# EAGLE design UAVCAN_HUB_0.1 (EAGLE 7.7.0)
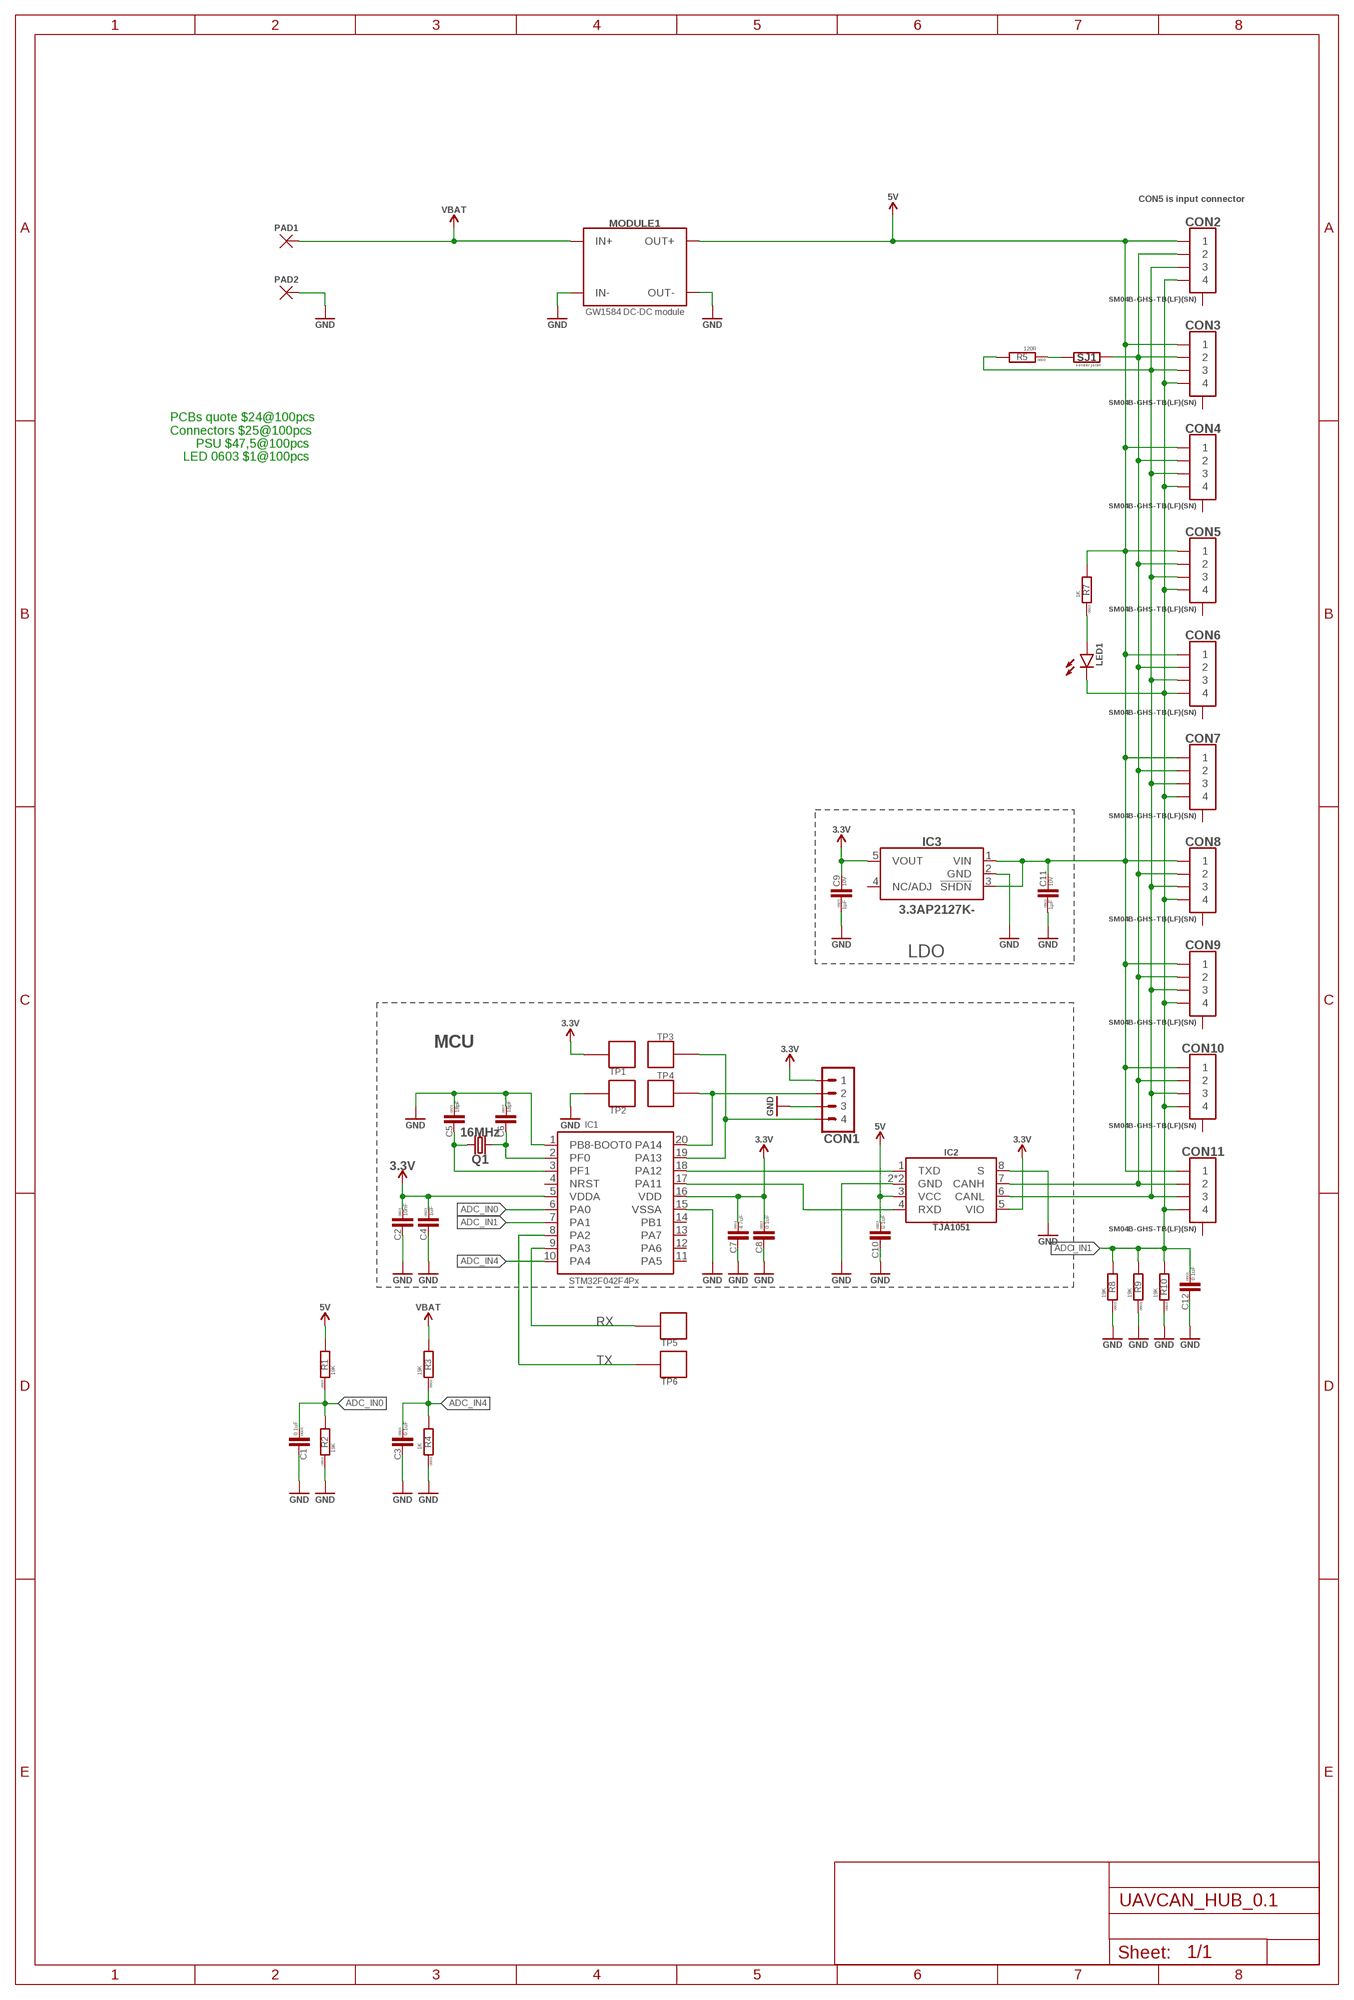
[diagram p0: schematic, sheet 1]

## Parts
C1  0.1uF  C-0603  [C0603]
C2  10nF  C-0603  [C0603]
C3  0.1uF  C-0603  [C0603]
C4  1uF  C-0603  [C0603]
C5  18pF  C-0603  [C0603]
C6  18pF  C-0603  [C0603]
C7  4.7uF  C-0603  [C0603]
C8  0.1uF  C-0603  [C0603]
C9  1µF  1µF-10V_10%_X7R-0603  [C0603]
C10  0.1uF  C-0603  [C0603]
C11  1µF  1µF-10V_10%_X7R-0603  [C0603]
C12  0.1uF  C-0603  [C0603]
CON1  PINHEAD_1X04-2.54  [1X04-PTH-2.54]
CON2  CON-4P-JST_GH  [JST_GH-4P]
CON3  CON-4P-JST_GH  [JST_GH-4P]
CON4  CON-4P-JST_GH  [JST_GH-4P]
CON5  CON-4P-JST_GH  [JST_GH-4P]
CON6  CON-4P-JST_GH  [JST_GH-4P]
CON7  CON-4P-JST_GH  [JST_GH-4P]
CON8  CON-4P-JST_GH  [JST_GH-4P]
CON9  CON-4P-JST_GH  [JST_GH-4P]
CON10  CON-4P-JST_GH  [JST_GH-4P]
CON11  CON-4P-JST_GH  [JST_GH-4P]
IC1  STM32F042F4PX  [TSSOP20]
IC2  TJA1051  [SOT782-1]
IC3  3.3  AP2127-3.3  [SOT23-5L]
LED1  LED-0603  [LED0603]
MODULE1  GW1584  [GW1584]
PAD1  PAD-4X2  [4X2]
PAD2  PAD-4X2  [4X2]
Q1  16MHz  CRYSTAL-3.2X2.5-4P  [OSCILLATOR-3.2X2.5]
R1  19K  R-0603  [R0603]
R2  19K  R-0603  [R0603]
R3  19K  R-0603  [R0603]
R4  1K  R-0603  [R0603]
R5  120R  R-0603  [R0603]
R7  1K  R-0603  [R0603]
R8  19K  R-0603  [R0603]
R9  19K  R-0603  [R0603]
R10  19K  R-0603  [R0603]
SJ1  SOLDER_JOINT_2P  [SJ_2P]
TP1  PAD.05  [PAD.05X.05]
TP2  PAD.05  [PAD.05X.05]
TP3  PAD.05  [PAD.05X.05]
TP4  PAD.05  [PAD.05X.05]
TP5  PAD.05  [PAD.05X.05]
TP6  PAD.05  [PAD.05X.05]

## Nets
ADC_IN0: C1.1 IC1.6(PA0) R1.1 R2.2
ADC_IN1: C12.1 CON2.4 CON3.4 CON4.4 CON5.4 CON6.4 CON7.4 CON8.4 CON9.4 CON10.4 CON11.4 IC1.7(PA1) LED1.C R8.2 R9.2 R10.2
ADC_IN4: C3.1 IC1.10(PA4) R3.1 R4.2
CAN_RX: IC1.17(PA11) IC2.4(RXD)
CAN_TX: IC1.18(PA12) IC2.1(TXD)
GND: C1.2 C2.2 C3.2 C4.2 C5.1 C6.1 C7.2 C8.2 C9.P$1 C10.2 C11.P$1 C12.2 CON1.3 IC1.1(PB8-BOOT0) IC1.15(VSSA) IC2.2(GND) IC2.8(S) IC2.PAD(GND) IC3.2(GND) MODULE1.IN-@1(IN-) MODULE1.IN-@2(IN-) MODULE1.OUT-@1(OUT-) MODULE1.OUT-@2(OUT-) PAD2.P$1 R2.1 R4.1 R8.1 R9.1 R10.1 TP2.P$1
N$2: CON2.3 CON3.3 CON4.3 CON5.3 CON6.3 CON7.3 CON8.3 CON9.3 CON10.3 CON11.3 IC2.6(CANL) R5.2
N$3: C6.2 IC1.2(PF0) Q1.1
N$5: C5.2 IC1.3(PF1) Q1.3
N$7: CON1.4 IC1.19(PA13) TP3.P$1
N$16: LED1.A R7.1
N$17: R5.1 SJ1.1
N$19: CON1.2 IC1.20(PA14) TP4.P$1
N$20: CON2.2 CON3.2 CON4.2 CON5.2 CON6.2 CON7.2 CON8.2 CON9.2 CON10.2 CON11.2 IC2.7(CANH) SJ1.2
RX: IC1.9(PA3) TP5.P$1
TX: IC1.8(PA2) TP6.P$1
VBAT [HV]: MODULE1.IN+@1(IN+) MODULE1.IN+@2(IN+) PAD1.P$1 R3.2
VDD_3V3: C2.1 C4.1 C7.1 C8.1 C9.P$2 CON1.1 IC1.5(VDDA) IC1.16(VDD) IC2.5(VIO) IC3.5(VOUT) TP1.P$1 ; supply symbol labelled 3.3V
VDD_5V: C10.1 C11.P$2 CON2.1 CON3.1 CON4.1 CON5.1 CON6.1 CON7.1 CON8.1 CON9.1 CON10.1 CON11.1 IC2.3(VCC) IC3.1(VIN) IC3.3(!SHDN) MODULE1.OUT+@1(OUT+) MODULE1.OUT+@2(OUT+) R1.2 R7.2 ; supply symbol labelled 5V
Unconnected: CON2.M$0(GND) CON2.M$1(GND) CON3.M$0(GND) CON3.M$1(GND) CON4.M$0(GND) CON4.M$1(GND) CON5.M$0(GND) CON5.M$1(GND) CON6.M$0(GND) CON6.M$1(GND) CON7.M$0(GND) CON7.M$1(GND) CON8.M$0(GND) CON8.M$1(GND) CON9.M$0(GND) CON9.M$1(GND) CON10.M$0(GND) CON10.M$1(GND) CON11.M$0(GND) CON11.M$1(GND) IC1.4(NRST) IC1.11(PA5) IC1.12(PA6) IC1.13(PA7) IC1.14(PB1) IC3.4(NC/ADJ) Q1.2(GND) Q1.4(GND)

## Notes on the sheet
- CON5 is input connector
- PCBs quote $24@100pcs
  Connectors $25@100pcs
- PSU $47,5@100pcs
- LED 0603 $1@100pcs
- LDO
- MCU

## Library data of the parts
C1-C8 C10 C12 = rc:C; PACKAGE: 0603
C9 C11 = C_digikey:1µF; DIGIKEY#: 587-1242-1-ND; MANF: Taiyo Yuden; MANF#: LMK107B7105KA-T; OPERATING_TEMP: -55°C ~ 125°C; PACKAGE: 0603; TC: X7R; TOLERANCE: +-10%; VOLTAGE: 10V
CON1 = pinhead:PINHEAD_1X04
CON2-CON10 = Connectors:CON-4P: Connector Receptacle 4 Position 0.049" (1.25mm) Tin Surface Mount, Right Angle; DIGIKEY#: 455-1566-1-ND; MANF: JST Sales America Inc; MANF#: SM04B-GHS-TB(LF)(SN); PITCH: 1.25mm
CON11 = Connectors:CON-4P: Connector Receptacle 4 Position 0.049" (1.25mm) Tin Surface Mount, Right Angle; DIGIKEY#: 455-1566-1-ND; LINK: https://ru.aliexpress.com/item/Free-shipping-100PCS-1-25mm-Locked-GH-Connector-2P3P4P5P6P8P-SMT-SMT-Desktop-Receptacle-JST-A1257/32817933978.html?spm=a2g0v.search0204.3.22.2a5262c5WEGWLY&ws_ab_test=searchweb0_0,searchweb201602_4_10152_10151_10065_10344_10068_10342_10343_10340_10341_10543_10084_10083_10618_10307_10301_5711215_10313_10059_10534_100031_10103_10627_10626_10624_10623_10622_5711315_10621_10620_5722415_10125,searchweb201603_1,ppcSwitch_5_ppcChannel&algo_expid=daf8f97f-539e-4c17-87f1-5110af5e6e4a-3&algo_pvid=daf8f97f-539e-4c17-87f1-5110af5e6e4a&transAbTest=ae803_4&priceBeautifyAB=0; MANF: JST Sales America Inc; MANF#: SM04B-GHS-TB(LF)(SN); PITCH: 1.25mm
IC1 = stm32:STM32F042F4PX; COMPEL: http://www.compel.ru/infosheet/ST/STM32F042F4P6/; MANF: STMicroelectronics; MANF#: STM32F042F4P6
IC2 = myxa_masterlib:TJA1051: 1/1 Transceiver Half CAN 8-HVSON (3x3); DIGIKEY#: 568-8686-2-ND; MANF: NXP Semiconductors; MANF#: TJA1051TK/3,118
IC3 = usb2can_master_lib:AP2127-3.3: IC REG LDO 3.3V 0.3A SOT23-5; DIGIKEY#: AP2127K-3.3TRG1DITR-ND; MANF: Diodes Incorporated; MANF#: AP2127K-3.3TRG1
LED1 = rc:LED: SMD LED; COLOR: RED
MODULE1 = ali_modules:GW1584: THIS http://mysku.ru/blog/aliexpress/35938.html http://ru.aliexpress.com/item/New-Mini-Converter-Adjustable-DC-DC-Step-down-Power-Supply-Module-replace-LM2596/32411413046.html?spm=2114.30010708.3.314.AhmzLw&s=p&ws_ab_test=searchweb201556_6,searchweb201602_5_10017_10010_10011_10018_10019_10036_10035_10034_301_507_10033_10032_10020_10001_10002_10005_10006_10021_10003_10022_10004_401_10009_10007_10008_2030013,searchweb201603_9&btsid=8a54b1af-cc82-4f8d-a784-d3b67147a089; LINK: https://ru.aliexpress.com/item/Free-Shipping-100PCS-GW1584-Ultra-small-size-DC-DC-step-down-power-supply-module-3A-adjustable/1985878488.html?spm=a2g0v.search0204.3.23.518b452bn6RfqA&ws_ab_test=searchweb0_0,searchweb201602_4_10152_10151_10065_10344_10068_10342_10343_10340_10341_10543_10084_10083_10618_10307_10301_5711215_10313_10059_10534_100031_10103_10627_10626_10624_10623_10622_5711315_10621_10620_5722415_10125,searchweb201603_1,ppcSwitch_5_ppcChannel&algo_expid=28ca32a4-d6d8-41f7-a9b9-1d14e93cca82-3&algo_pvid=28ca32a4-d6d8-41f7-a9b9-1d14e93cca82&transAbTest=ae803_4&priceBeautifyAB=0
PAD1 PAD2 = PADS:PAD; BOM: EXCLUDE
Q1 = watchdog_master_library:CRYSTAL: Smd Crystal; DIGIKEY#: 1253-1182-1-ND; MANF: AVX Corp/Kyocera Corp; MANF#: CX3225GB16000P0HPQCC
R1-R5 R7-R10 = rc:R; PACKAGE: 0603
SJ1 = misc:SOLDER_JOINT_2P; BOM: EXCLUDE
TP1-TP6 = misc:PAD: Test pad This footprint includes three classes: The actual test pads, a pogo-pin footprint to mount the pogo-pin as through-hole part and a hole footprint which allows the head of the pogo-pin to pass through (do NOT use the hole to mount the pogo-pin). In a typical test setup, the stack would consist of three PCBs: The actual PCB under testing with a test pad on the bottom, then a second PCB with the hole for the pogo-pin head where the PCB under testing is pressed on and a third PCB at 30 mm / 1.2" distance with the pogo-pin footprints. The pogo-pins are soldered to the last PCB. To create the stack, copy the board under testing and exchange the footprints - this way the correct positioning is ensured.; BOM: EXCLUDE; PARTNO: *

## Net classes
1 HV: clearance 0.3 mm to class 0

## Board
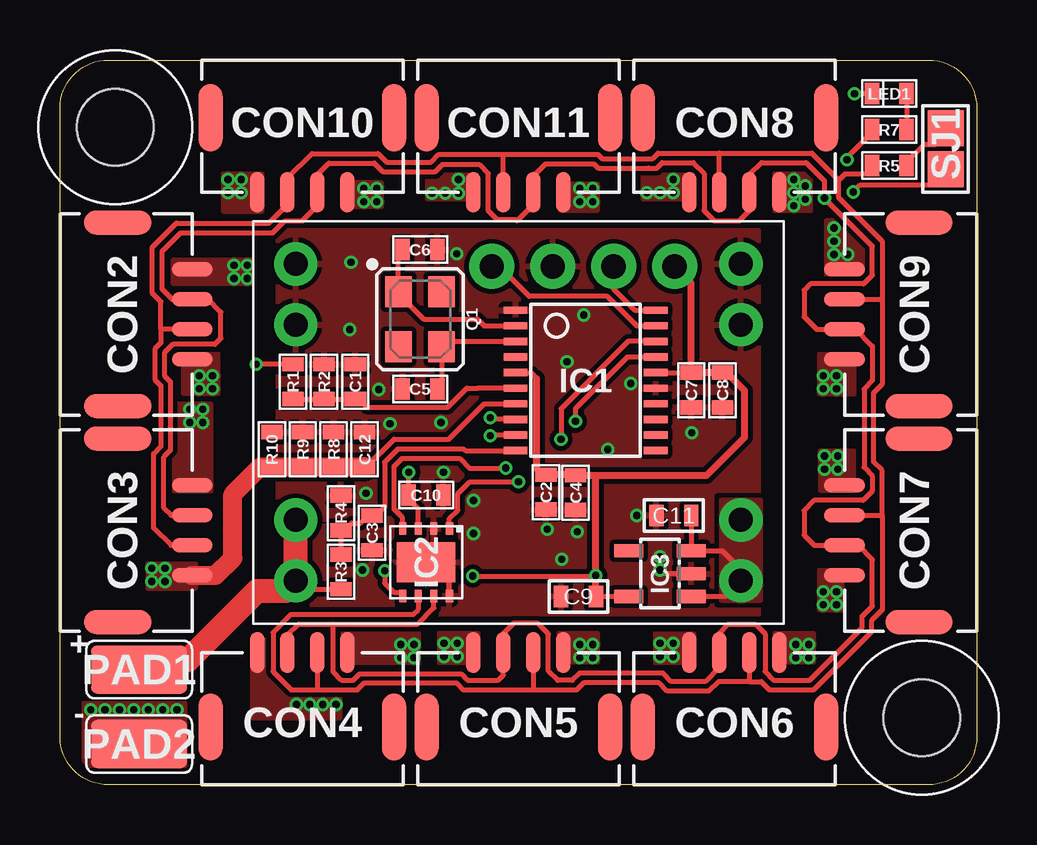
[diagram p1: board, top side]
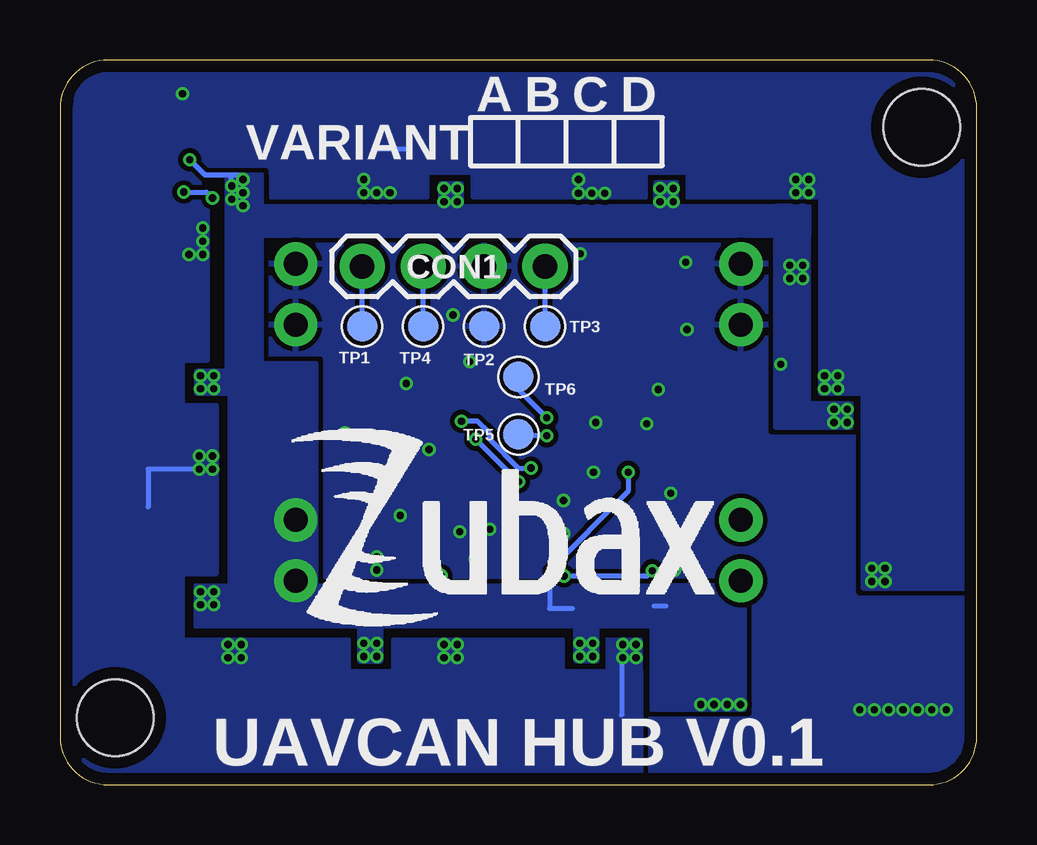
[diagram p2: board, bottom side, seen from below]

Size 38.2 x 30.2 mm. Coordinates in mm from the lower left corner, seen from the top.
Outline: 2,30.2 36.2,30.2 arc-90 38.2,28.2 38.2,2 arc-90 36.2,0 2,0 arc-90 0,2 0,28.2 arc-90 2,30.2
Copper layers (1*16): Top 0.035mm / dielectric 0.5mm / Bottom 0.035mm
Design rules "usb2can_drc": minimum track width 0.2mm, minimum drill 0.2mm, track to track 0.2mm, track to pad 0.2mm, pad to pad 0.2mm, via to via 0.2mm, smd to smd 0.15mm, copper to edge 0.5mm, drill to drill 0.2mm, minimum pad ring 0.125mm, minimum via ring 0.125mm, stop-mask expansion 1mil, vias tented up to drill 0.31mm, thermal gap 8mil
Holes 3.2 mm at 35.9,2.8 2.3,27.4

### Footprints (pad centres in the part's own frame; a part is rotated, then mirrored left to right if it is on the bottom)
C0603 = smd 0.6 x 0.9: 1 -0.725,0; 2 0.725,0
C0603' = smd 0.6 x 0.9: P$1 -0.725,0; P$2 0.725,0
1X04-PTH-2.54 = drill 1.016 pad 1.88: 1 -3.81,0; 2 -1.27,0; 3 1.27,0; 4 3.81,0
JST_GH-4P = smd 0.6 x 1.7: 1 1.875,-2.91; 2 0.625,-2.91; 3 -0.625,-2.91; 4 -1.875,-2.91 | smd 1 x 2.8: M$0 -3.825,0.19; M$1 3.825,0.19
TSSOP20 = smd 0.991 x 0.305: 1 -2.918,2.925; 2 -2.918,2.275; 3 -2.918,1.625; 4 -2.918,0.975; 5 -2.918,0.325; 6 -2.918,-0.325; 7 -2.918,-0.975; 8 -2.918,-1.625; 9 -2.918,-2.275; 10 -2.918,-2.925; 11 2.918,-2.925; 12 2.918,-2.275; 13 2.918,-1.625; 14 2.918,-0.975; 15 2.918,-0.325; 16 2.918,0.325; 17 2.918,0.975; 18 2.918,1.625; 19 2.918,2.275; 20 2.918,2.925
SOT782-1 = smd 0.525 x 0.3: 1 -1.4,0.975; 2 -1.4,0.325; 3 -1.4,-0.325; 4 -1.4,-0.975; 5 1.4,-0.975; 6 1.4,-0.325; 7 1.4,0.325; 8 1.4,0.975 | smd 1.65 x 2.45: PAD 0,0
SOT23-5L = smd 0.55 x 1.2: 1 -0.95,-1.3; 2 0,-1.3; 3 0.95,-1.3; 4 0.95,1.3; 5 -0.95,1.3
LED0603 = smd 0.6 x 0.9: A -0.725,0; C 0.725,0
GW1584 = drill 1 pad 1.8: IN+@1 9.271,6.604; IN+@2 9.271,4.064; IN-@1 9.271,-6.604; IN-@2 9.271,-4.064; OUT+@1 -9.271,6.604; OUT+@2 -9.271,4.064; OUT-@1 -9.271,-4.064; OUT-@2 -9.271,-6.604
4X2 = smd 4 x 2: P$1 0,0
OSCILLATOR-3.2X2.5 = smd 1.3 x 1.1: 1 -1.15,-0.9; 2 1.15,-0.9; 3 1.15,0.9; 4 -1.15,0.9
R0603 = smd 0.6 x 0.9: 1 -0.725,0; 2 0.725,0
SJ_2P = smd 1.5 x 1.5: 1 -0.85,0; 2 0.85,0
PAD.05X.05 = smd 1.27 x 1.27: P$1 0,0

### Placement (x,y rotation side)
C1  12.3,16.8 90 top
C2  20.25,12.19 270 top
C3  13,10.5 270 top
C4  21.49,12.17 270 top
C5  15,16.5 0 top
C6  15,22.3 180 top
C7  26.3,16.45 270 top
C8  27.6,16.45 270 top
C9  1µF  [C0603']  21.6,7.85 0 top
C10  15.25,12.07 0 top
C11  1µF  [C0603']  25.58,11.22 0 top
C12  12.69,13.97 90 top
CON1  21.8,21.6 0 bottom
CON2  2.6,19.6 90 top
CON3  2.6,10.6 90 top
CON4  10.1,2.6 180 top
CON5  19.1,2.6 180 top
CON6  28.1,2.6 180 top
CON7  35.6,10.6 270 top
CON8  28.1,27.6 0 top
CON9  35.6,19.6 270 top
CON10  10.1,27.6 0 top
CON11  19.1,27.6 0 top
IC1  21.9,16.85 0 top
IC2  15.25,9.27 270 top
IC3  25,8.8 90 top
LED1  34.55,28.8 180 top
MODULE1  19.1,15.1 180 top
PAD1  3.3,4.8 0 top
PAD2  3.3,1.7 0 top
Q1  15,19.4 270 top
R1  9.7,16.8 90 top
R2  11,16.8 270 top
R3  11.7,8.88 270 top
R4  11.7,11.32 270 top
R5  34.55,25.8 180 top
R7  34.55,27.3 180 top
R8  11.4,13.98 270 top
R9  10.11,13.98 270 top
R10  8.83,13.97 270 top
SJ1  36.9,26.5 270 top
TP1  25.61,19.1 90 bottom
TP2  20.53,19.1 90 bottom
TP3  17.99,19.1 0 bottom
TP4  23.07,19.1 0 bottom
TP5  19.1,14.6 180 bottom
TP6  19.1,17 180 bottom
U$13  [ZUBAX_LOGO_18X8]  19.1,9.85 0 bottom

### Tracks (layer width: path | path; a pad name or v marks a point on that pad's centre or on a via)
ADC_IN0
  Top 0.2: R1.1 R2.2 C1.1 | C1.1 12.4,16.07 | IC1.6 17.6,16.52 17.43,16.52 16.95,16.52 16.15,15.72 12.8,15.72 12.45,16.07 C1.1
ADC_IN1  (via drill 0.3)
  Top 0.2: C12.1 12.77,13.25 13.92,14.4 16.2,14.4 17.68,15.88 IC1.7 | LED1.C v33.1,28.8
  Top 0.8: CON3.4 6.48,8.72 7.2,9.45 7.2,12.1 8.35,13.25 R10.2 8.83,13.26 R9.2 R8.2 C12.1
  Bottom 0.2: 25,26.5 23.83,26.5 | v32.4,13.15 34.53,13.15 34.53,11.57 | v14.75,5.3 14.8,5.25 14.8,2.9
  other vias: 14.75,5.85 14.2,5.85 14.2,5.3 21.65,5.85 22.2,5.85 22.2,5.3 21.65,5.3 30.65,5.85 31.2,5.85 31.2,5.3 30.65,5.3 31.85,13.15 31.85,13.7 32.4,13.7 32.25,22.1 32.25,22.65 32.25,23.2 32.83,22.1 25.55,24.67 25,24.67 24.45,24.67 25.55,25.23 16.6,24.65 16.05,24.65 15.5,24.65 16.6,25.23 7.55,24.67 7,24.67 7,25.23 7.55,25.23 6.35,17.05 6.35,16.5 5.8,16.5 5.8,17.05 3.83,9.02 3.83,8.47 4.38,8.47 4.38,9.02
  pour Bottom (no thermals): 14,3.5 14,6.03 15.38,6.03 15.38,3.5
  pour Top (no thermals): 14.95,5.1 14.95,6.3 11.78,6.3 11.78,5.1
  pour Top (no thermals): 22.4,5.12 22.4,6.3 20.78,6.3 20.78,5.12
  pour Bottom (no thermals): 17.26,3.5 17.26,6.03 24.3,6.03 24.3,3.5
  pour Bottom (no thermals): 26.17,3.5 26.17,6.03 35.1,6.03 35.1,3.5
  pour Top (no thermals): 31.4,5.12 31.4,6.3 29.78,6.3 29.78,5.12
  pour Top (no thermals): 33.08,13.9 31.68,13.9 31.68,12.27 33.08,12.27
  pour Bottom (no thermals): 35.1,8.8 31.68,8.8 31.68,15.8 35.1,15.8
  pour Bottom (no thermals): 35.1,17.7 32.05,17.7 32.05,27.06 35.1,27.07
  pour Top (no thermals): 33.5,23.5 31.93,23.5 31.93,21.2 33.5,21.2
  pour Bottom (no thermals): 29.4,27.07 29.4,24.5 22.9,24.5 22.9,27.07
  pour Top (no thermals): 24.28,25.4 24.28,24.42 26.36,24.42 26.36,25.4
  pour Bottom (no thermals): 21,26.4 21,24.5 13.8,24.5 13.8,26.4
  pour Top (no thermals): 15.3,25.4 15.3,24.42 17.36,24.42 17.36,25.4
  pour Bottom (no thermals): 12.05,26.7 12.05,24.5 4.33,24.5 4.33,26.7
  pour Top (no thermals): 6.8,25.45 6.8,23.9 8.43,23.9 8.43,25.45
  pour Bottom (no thermals): 3.63,25.23 6.53,25.23 6.53,16.32 3.63,16.32
  pour Top (no thermals): 5.13,16.32 6.6,16.32 6.6,17.93 5.13,17.93
  pour Top (no thermals): 3.65,8.2 5.65,8.2 5.65,9.2 3.65,9.2
  pour Bottom (rank 3, no thermals): 34.48,29.7 0.83,29.7 0.83,25.5 34.48,25.5
  pour Bottom (no thermals): 33.1,29.7 33.1,3.5 37.6,3.5 37.6,29.7
  pour Bottom (rank 3, no thermals): 14,0.5 37.6,0.5 37.6,4.72 14,4.72
  pour Bottom (rank 2, no thermals): 0.5,29.7 0.5,8.18 4.73,8.18 4.73,29.7
ADC_IN4
  Top 0.2: 11.75,9.5 11.7,9.55 R3.1 R4.2 11.85,10.6 12.15,10.9 12.53,10.9 12.85,11.22 C3.1 13.18,11.22 13.53,11.57 13.53,13.44 14.08,14 16.82,14 16.89,13.92 IC1.10
CAN_RX  (via drill 0.3)
  Top 0.2: IC2.4 14.28,11.12 13.93,11.47 13.93,13.28 14.25,13.6 16.65,13.6 17.05,13.2 v18.58,13.2 | IC1.17 23.62,17.82 21.48,15.67 v21.48,15.15
  Bottom 0.2: v18.58,13.2 19.11,13.2 20.3,14.39 20.3,14.64 20.81,15.15 v21.48,15.15
CAN_TX  (via drill 0.3)
  Top 0.2: IC2.1 16.23,11.1 16.58,11.45 16.58,12.12 17.08,12.62 v19.1,12.62 | IC1.18 23.68,18.48 20.88,15.67 v20.88,14.4
  Bottom 0.2: v19.1,12.62 v20.88,14.4
GND  (via drill 0.3)
  Top 0.2: IC2.8 16.23,9.27 IC2.PAD | 15.98,11.9 C10.2 | IC3.2 25,8.8 v25,8.95
  Bottom 0.2: v25,8.95 v25,9.5
  other vias: 24.03,11.22 15.98,13.02 26.33,14.67 20.3,10.65 21.55,10.55 13.75,15.05 13.28,16.48 12.08,18.98 12.13,21.77 16.53,22.12 21.12,17.62 21.83,19.57 23.78,16.73 22.83,13.97 12.75,12.15 12.6,8.95 20.9,9.4 17.23,10.47 17.23,11.85 15.88,15.1 1.28,3.12 1.88,3.12 2.48,3.12 3.08,3.12 3.68,3.12 4.28,3.12 4.88,3.12
  pour Bottom (rank 5): 0,2 0,28.2 arc-90 2,30.2 36.2,30.2 arc-90 38.2,28.2 38.2,2 arc-90 36.2,0 2,0 arc-90
  pour Top (rank 2): 9.1,23.1 29.1,23.1 29.1,7.1 9.1,7.1
  pour Top (no thermals): 5.2,0.8 1,0.8 1,3.4 5.2,3.4
N$2
  Top 0.2: CON6.3 28.73,4.3 | CON2.3 4.2,18.98 | CON3.3 4.63,9.97 3.9,10.7 3.9,13.8 4.2,14.1 4.2,16.63 3.95,16.88 3.95,18.17 4.2,18.42 4.2,18.98 | 4.2,18.98 4.2,20.13 3.85,20.48 3.85,22.4 4.85,23.4 8.7,23.4 9.48,24.17 CON10.3 9.48,25.27 10.5,26.3 13.26,26.3 13.61,25.95 15.47,25.95 15.79,26.27 18.46,26.27 | CON11.3 18.48,26.25 18.46,26.27 | 18.46,26.27 22.41,26.27 22.59,26.09 24.69,26.09 24.93,26.32 27.48,26.32 | CON8.3 27.48,26.32 | 27.48,26.32 31.33,26.32 32.45,25.2 | 33.4,20.23 CON9.3 34.2,20.23 34.25,20.27 | 34.25,20.27 34.25,22.65 32.45,24.45 32.45,25.2 | 34.25,20.27 34.25,16.68 33.9,16.33 33.9,13.45 34.25,13.1 34.25,11.22 | CON7.3 34.25,11.22 | 34.25,11.22 34.25,7.28 33.83,6.86 33.83,6.38 31.4,3.96 29.56,3.96 29.22,4.3 28.73,4.3 | 28.73,4.3 27.44,4.3 27.04,3.9 25.31,3.9 24.96,4.25 21.82,4.25 21.52,3.95 19.73,3.95 | 19.73,4.8 CON5.3 19.73,3.95 | 19.73,3.95 16.82,3.95 16.55,4.22 12.65,4.22 12.39,3.96 10.73,3.96 | 10.73,4.8 CON4.3 10.73,3.96 | IC2.6 14.93,7.3 14.73,7.1 9.63,7.1 8.88,6.34 8.88,4.71 9.63,3.96 10.73,3.96 | R5.2 33.83,25.67 33.6,25.45 32.7,25.45 32.45,25.2
N$3
  Top 0.2: IC1.2 17.68,19.12 17.4,19.4 15.15,19.4 14.11,20.44 Q1.1 14.1,22.12 C6.2
N$5
  Top 0.2: IC1.3 16.13,18.48 Q1.3 15.9,16.68 C5.2
N$7
  Top 0.2: IC1.19 24.03,19.12 22.81,20.35 19.55,20.35 18.3,21.6 CON1.4
  Bottom 0.2: TP3.P$1 CON1.4
N$16
  Top 0.2: LED1.A R7.1
N$17
  Top 0.2: R5.1 35.28,25.98 36,26.7 36.5,26.7 36.9,27.1 | 36.9,27.1 36.95,27.15 | 36.9,27.1 SJ1.1
N$19
  Top 0.2: IC1.20 23.95,19.77 23.07,20.66 CON1.2
  Bottom 0.2: TP4.P$1 CON1.2
N$20  (via drill 0.3)
  Top 0.2: 18.48,4.92 CON5.2 | CON3.2 4.63,11.22 4.33,11.52 4.33,13.66 4.6,13.93 4.6,16.8 4.35,17.05 4.35,18 4.7,18.35 6.45,18.35 6.7,18.6 6.7,19.7 6.18,20.23 CON2.2 4.68,20.23 4.25,20.65 4.25,22.23 5.03,23 5.3,23 5.4,23 8.87,23 9.37,23.5 10.1,23.5 10.73,24.12 CON10.2 10.73,25.42 11.2,25.9 13.1,25.9 13.45,25.55 15.64,25.55 15.94,25.85 17.46,25.85 17.85,25.46 17.85,23.91 18.23,23.54 19.01,23.54 19.05,23.5 19.73,24.17 CON11.2 19.73,25.36 20.24,25.87 22.25,25.87 22.43,25.69 24.52,25.69 24.86,25.69 25.09,25.92 26.39,25.92 26.84,25.47 26.84,23.93 27.27,23.5 28.3,23.5 28.73,23.94 28.73,24.68 CON8.2 28.73,25.41 29.23,25.92 31.09,25.92 31.85,25.16 v31.85,24.45 33.85,22.45 33.85,21.24 33.49,20.88 31.26,20.88 31,20.61 31,19.5 31.53,18.98 CON9.2 | CON9.2 32.65,18.98 | CON5.2 18.48,6.3 18.9,6.72 19.91,6.72 20.35,6.28 20.35,4.74 20.74,4.35 21.35,4.35 21.65,4.65 25.12,4.65 25.48,4.3 26.88,4.3 27.48,4.9 CON6.2 27.48,6.32 27.81,6.66 29.02,6.66 29.38,6.3 29.38,4.71 29.73,4.36 31.23,4.36 33.42,6.55 33.42,7.03 33.85,7.45 33.85,9.38 33.25,9.97 CON7.2 31.43,9.97 31,10.4 31,11.43 31.42,11.85 33.46,11.85 33.84,12.23 33.84,12.88 33.5,13.22 33.5,16.5 33.85,16.85 33.85,18.27 33.15,18.98 CON9.2 | CON5.2 18.48,4.57 18.26,4.36 16.98,4.36 16.71,4.62 12.49,4.62 12.22,4.36 11.73,4.36 11.38,4.71 11.38,6.7 | 9.48,4.82 CON4.2 9.48,6.22 9.95,6.7 11.38,6.7 | v33.05,24.7 33.35,25 36.3,25 36.3,25.05 SJ1.2 | 11.38,6.7 14.9,6.7 15.58,7.38 IC2.7
  Bottom 0.2: v33.05,24.7 32.1,24.7 v31.85,24.45
RX  (via drill 0.3)
  Top 0.2: IC1.9 17.95,14.57 v17.93,14.55
  Bottom 0.2: v17.93,14.55 19.05,14.55 TP5.P$1
TX  (via drill 0.3)
  Top 0.2: IC1.8 18,15.22 v17.93,15.3
  Bottom 0.2: v17.93,15.3 19.1,16.48 TP6.P$1
VBAT
  Top 0.2: 10.05,8.27 MODULE1.IN+@1 10.18,8.15 R3.2
  Top 1: MODULE1.IN+@2 MODULE1.IN+@1 9.41,8.07 8.2,8.07 5.33,5.2 4,5.2 3.5,4.7 PAD1.P$1
VDD_3V3  (via drill 0.3)
  Top 0.2: C9.P$2 IC3.5 | IC1.16 C7.1 | IC1.5 19.62,17.18 19.85,16.95 19.85,16.93 | 21.65,12.9 C4.1 | IC2.5 14.28,7.92 14.18,8.02 13.9,8.02 13.53,8.4 v13.53,8.93 | v17.2,8.7 22.33,8.7
  Top 0.3: 21.7,12.9 21.65,12.9 | 19.85,16.93 19.85,13.2 20.05,13 20.17,13 C2.1 21.47,12.92 C4.1 22.33,12.9 | 22.33,12.9 26.95,12.9 28.53,14.47 28.53,16.43 27.78,17.18 C8.1 C7.1 26.3,20.91 CON1.1 | C9.P$2 22.33,8.7 v22.33,8.72 22.33,12.9
  Bottom 0.2: TP1.P$1 CON1.1 | v13.53,8.93 13.75,8.7 v17.2,8.7
VDD_5V  (via drill 0.3)
  Top 0.2: CON6.1 26.23,5.95 | IC2.3 14.93,11.5 14.53,11.9 C10.1 v14.53,13.02 | IC3.1 27.73,7.85 MODULE1.OUT+@1 28.37,8.98 27.6,9.75 IC3.3 C11.P$2 | 9.5,17.73 R1.2 v8.18,17.52 | v32.8,26.05 32.8,26.14 33.83,27.17 R7.2
  Bottom 0.2: 31.1,25.4 v31.05,24.95 | 12.95,7.45 13.45,7.45 | v14.53,13.02 14.53,12.22 17.8,8.95 17.8,7.35 16.85,7.35 | v30.58,25.23 30.62,25.38 30.65,25.4 32.15,25.4 v32.8,26.05
  other vias: 16.55,5.35 16,5.35 16,5.9 16.55,5.9 25.55,5.35 25,5.35 25,5.9 25.55,5.9 32.35,8.05 32.35,7.5 31.8,7.5 31.8,8.05 32.35,17.05 32.35,16.5 31.8,16.5 31.8,17.05 21.65,24.85 22.2,24.85 22.2,24.3 21.65,24.3 12.65,24.85 13.2,24.85 13.2,24.3 12.65,24.3 7.8,21.65 7.25,21.65 7.8,21.1 7.25,21.1 5.4,15.1 5.4,15.65 5.95,15.65 5.95,15.1 10.4,3.35 9.85,3.35 10.95,3.35 11.5,3.35 30.58,24.67 31.05,24.4 30.58,24.12
  pour Bottom (no thermals): 16.73,7.98 16.73,5.17 15.83,5.17 15.83,7.98
  pour Top (no thermals): 15.8,6.3 15.8,5.1 17.43,5.1 17.43,6.3
  pour Bottom (no thermals): 25.73,8 25.73,5.15 24.83,5.15 24.83,8
  pour Top (no thermals): 24.8,6.28 24.8,5.1 26.43,5.1 26.43,6.28
  pour Bottom (no thermals): 31.62,8.22 32.53,8.22 32.53,7.32 31.62,7.32
  pour Top (no thermals): 31.62,7.3 32.6,7.3 32.6,8.93 31.62,8.93
  pour Bottom (no thermals): 29.09,17.23 32.53,17.23 32.53,16.32 29.09,16.32
  pour Top (no thermals): 31.62,16.3 33.1,16.3 33.1,17.93 31.62,17.93
  pour Top (no thermals): 22.4,23.95 22.4,25.03 20.84,25.03 20.84,23.95
  pour Bottom (no thermals): 21.48,23.18 21.45,25.04 22.35,25.04 22.38,23.18
  pour Bottom (no thermals): 12.48,23.18 12.5,25.09 13.4,25.09 13.38,23.18
  pour Top (no thermals): 13.4,24.11 13.4,25.08 11.86,25.08 11.84,24.11
  pour Top (rank 3, no thermals): 8,21.85 4.7,21.85 4.7,20.9 8,20.9
  pour Bottom (no thermals): 8.4,14.9 5.23,14.9 5.23,15.88 8.4,15.88
  pour Top (no thermals): 6.3,15.85 4.75,15.85 4.75,12.25 6.3,12.25
  pour Bottom (no thermals): 13.55,8.3 13.55,3.15 9.68,3.15 9.68,8.3
  pour Top (rank 2, no thermals): 8,6.03 8,2.8 11.68,2.8 11.68,6.03
  pour Top (no thermals): 31.29,23.94 31.29,25.44 29.78,25.44 29.78,23.94
  pour Bottom (no thermals): 29.8,16.95 29.8,25.4 31.25,25.4 31.25,16.95
  pour Bottom (no thermals): 32.53,8.3 31.11,8.3 31.11,17.56 27.55,17.56 27.55,8.3 10.93,8.3 10.93,6.6 32.53,6.6
  pour Bottom (no thermals): 30.8,24.1 7,24.1 7,22.88 30.8,22.88
  pour Bottom (no thermals): 7,15.1 7,24.1 8.4,24.1 8.4,15.1
  pour Top (no thermals): 27.55,7.7 29.2,7.7 29.2,11.85 27.55,11.85

### Text on the board
tPlace: + | -
bPlace: D | C | B | A | VARIANT | UAVCAN HUB V0.1